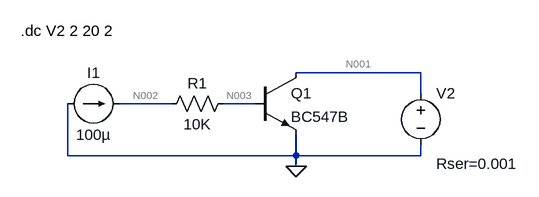
[diagram p0: schematic Draft1.asc]
Draft1.asc, the LTspice schematic file:
Version 4.1
SHEET 1 880 680
WIRE 272 16 80 16
WIRE 272 48 272 16
WIRE -112 64 -192 64
WIRE 16 64 -32 64
WIRE -272 144 -272 64
WIRE 80 144 80 112
WIRE 80 144 -272 144
WIRE 272 144 272 128
WIRE 272 144 80 144
WIRE 80 160 80 144
FLAG 80 160 0
SYMBOL npn 16 16 R0
SYMATTR InstName Q1
SYMATTR Value BC547B
SYMBOL res -16 48 R90
WINDOW 0 0 56 VBottom 2
WINDOW 3 32 56 VTop 2
SYMATTR InstName R1
SYMATTR Value 10K
SYMATTR SpiceLine tol=1 pwr=0.1
SYMBOL voltage 272 32 R0
WINDOW 123 0 0 Left 0
WINDOW 39 24 124 Left 2
SYMATTR SpiceLine Rser=0.001
SYMATTR InstName V2
SYMATTR Value ""
SYMBOL current -272 64 R270
WINDOW 0 32 40 VTop 2
WINDOW 3 -32 40 VBottom 2
WINDOW 123 0 0 Left 0
WINDOW 39 0 0 Left 0
SYMATTR InstName I1
SYMATTR Value 100µ
TEXT -344 -48 Left 2 !.dc V2 2 20 2

The netlist it stands for:
* Draft1.asc
Q1 N001 N003 0 0 BC547B
R1 N003 N002 10K tol=1 pwr=0.1
V2 N001 0 Rser=0.001
I1 0 N002 100µ
.model NPN NPN
.model PNP PNP
.lib standard.bjt
.dc V2 2 20 2
.backanno
.end

* Results of the author's LTspice run, read from the files saved beside the schematic
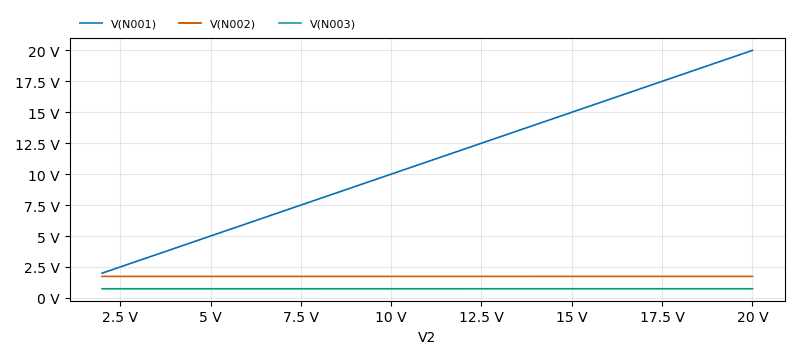
[diagram p1: DC transfer characteristic of Draft1.asc, plotted from the saved traces]
* DC transfer characteristic, 1 run:
*   V(N001): 2 V at V2=2 V, 20 V at V2=20 V, min 2 V, max 20 V
*   V(N002): 1.737 V at V2=2 V, 1.741 V at V2=20 V, min 1.737 V, max 1.741 V
*   V(N003): 737.4 mV at V2=2 V, 740.7 mV at V2=20 V, min 737.4 mV, max 740.7 mV